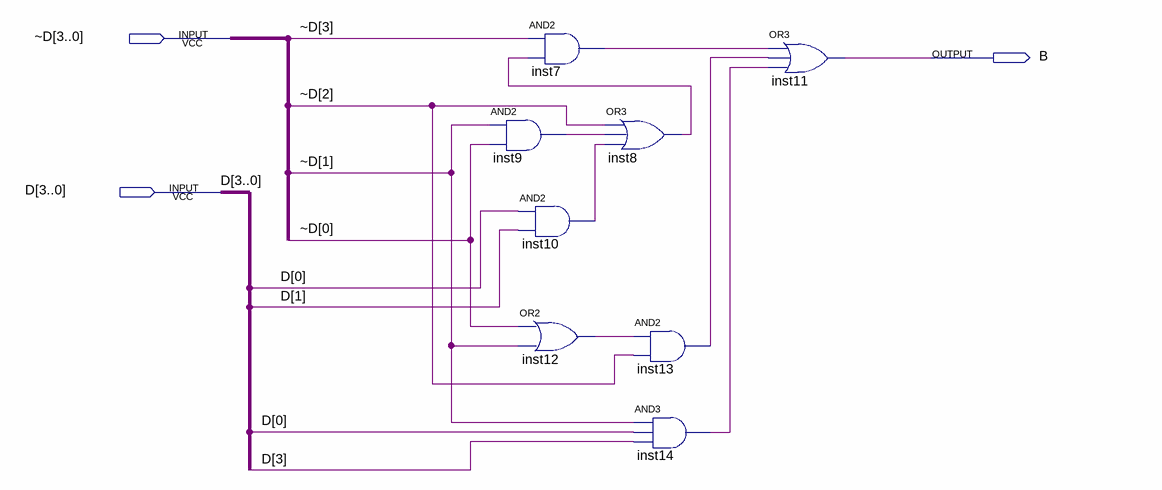
[diagram p0: schematic sheet]
// Quartus schematic SEG_B.bdf as structural Verilog: 8 symbols, 3 pins
module SEG_B (
  input  [3:0] \~D ,
  input  [3:0] D,
  output B
);

  wire inst7_out, inst8_out, inst9_out, inst10_out, inst12_out, inst13_out, inst14_out;

  and inst7 (inst7_out, \~D [3], inst8_out);
  and inst9 (inst9_out, \~D [1], \~D [0]);
  and inst10 (inst10_out, D[0], D[1]);
  or inst12 (inst12_out, \~D [0], \~D [1]);
  or inst8 (inst8_out, \~D [2], inst9_out, inst10_out);
  and inst13 (inst13_out, inst12_out, \~D [2]);
  and inst14 (inst14_out, \~D [1], D[0], D[3]);
  or inst11 (B, inst7_out, inst13_out, inst14_out);
endmodule
